# Altium schematic sheet mach nhan tin hieu.SchDoc
size A2
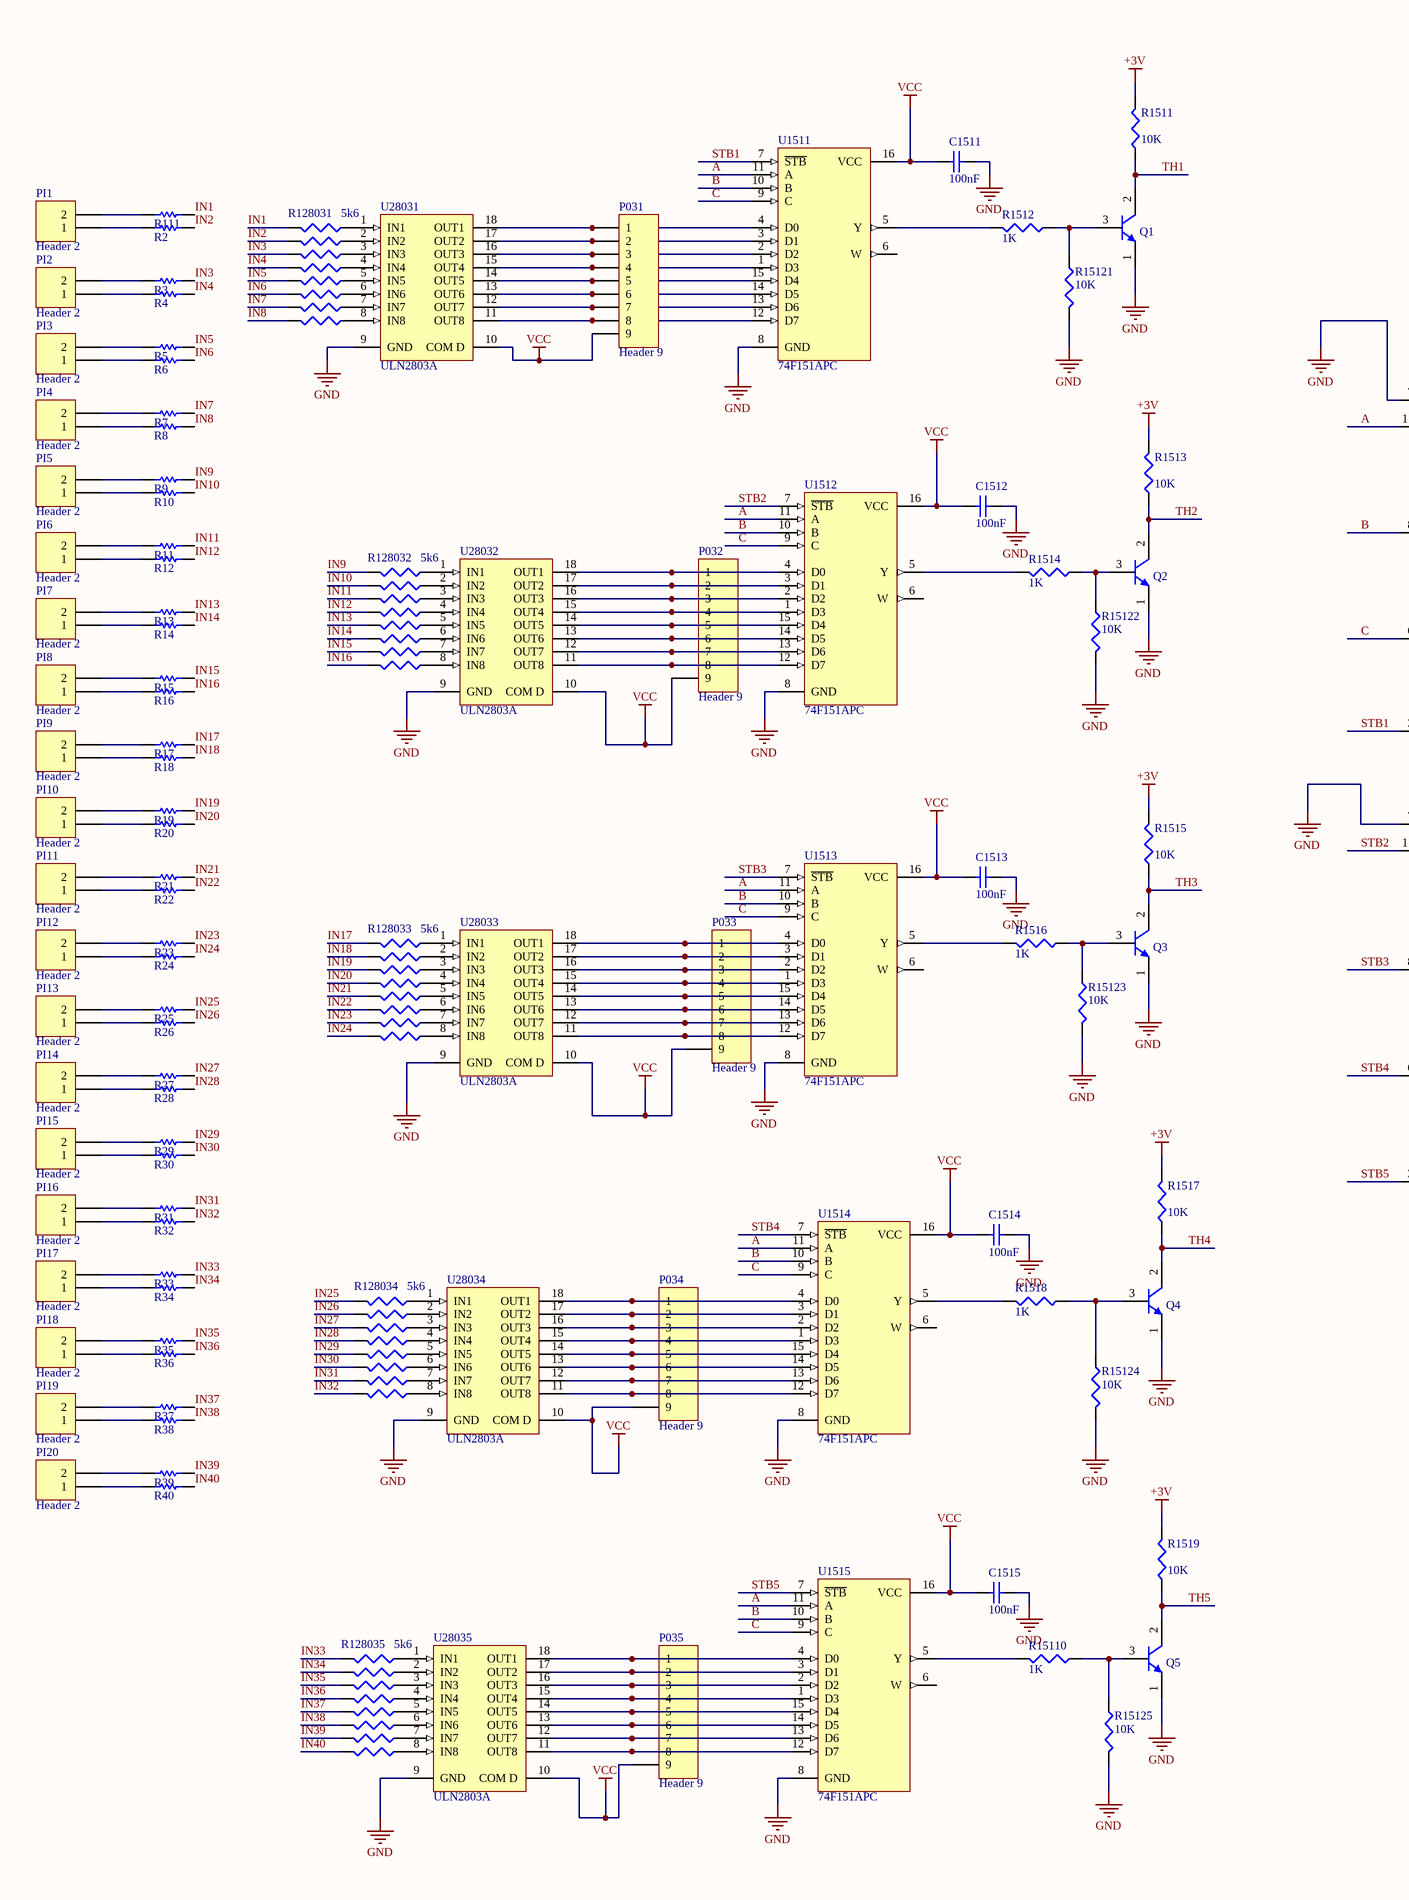
[diagram p0: mach nhan tin hieu.SchDoc, left]
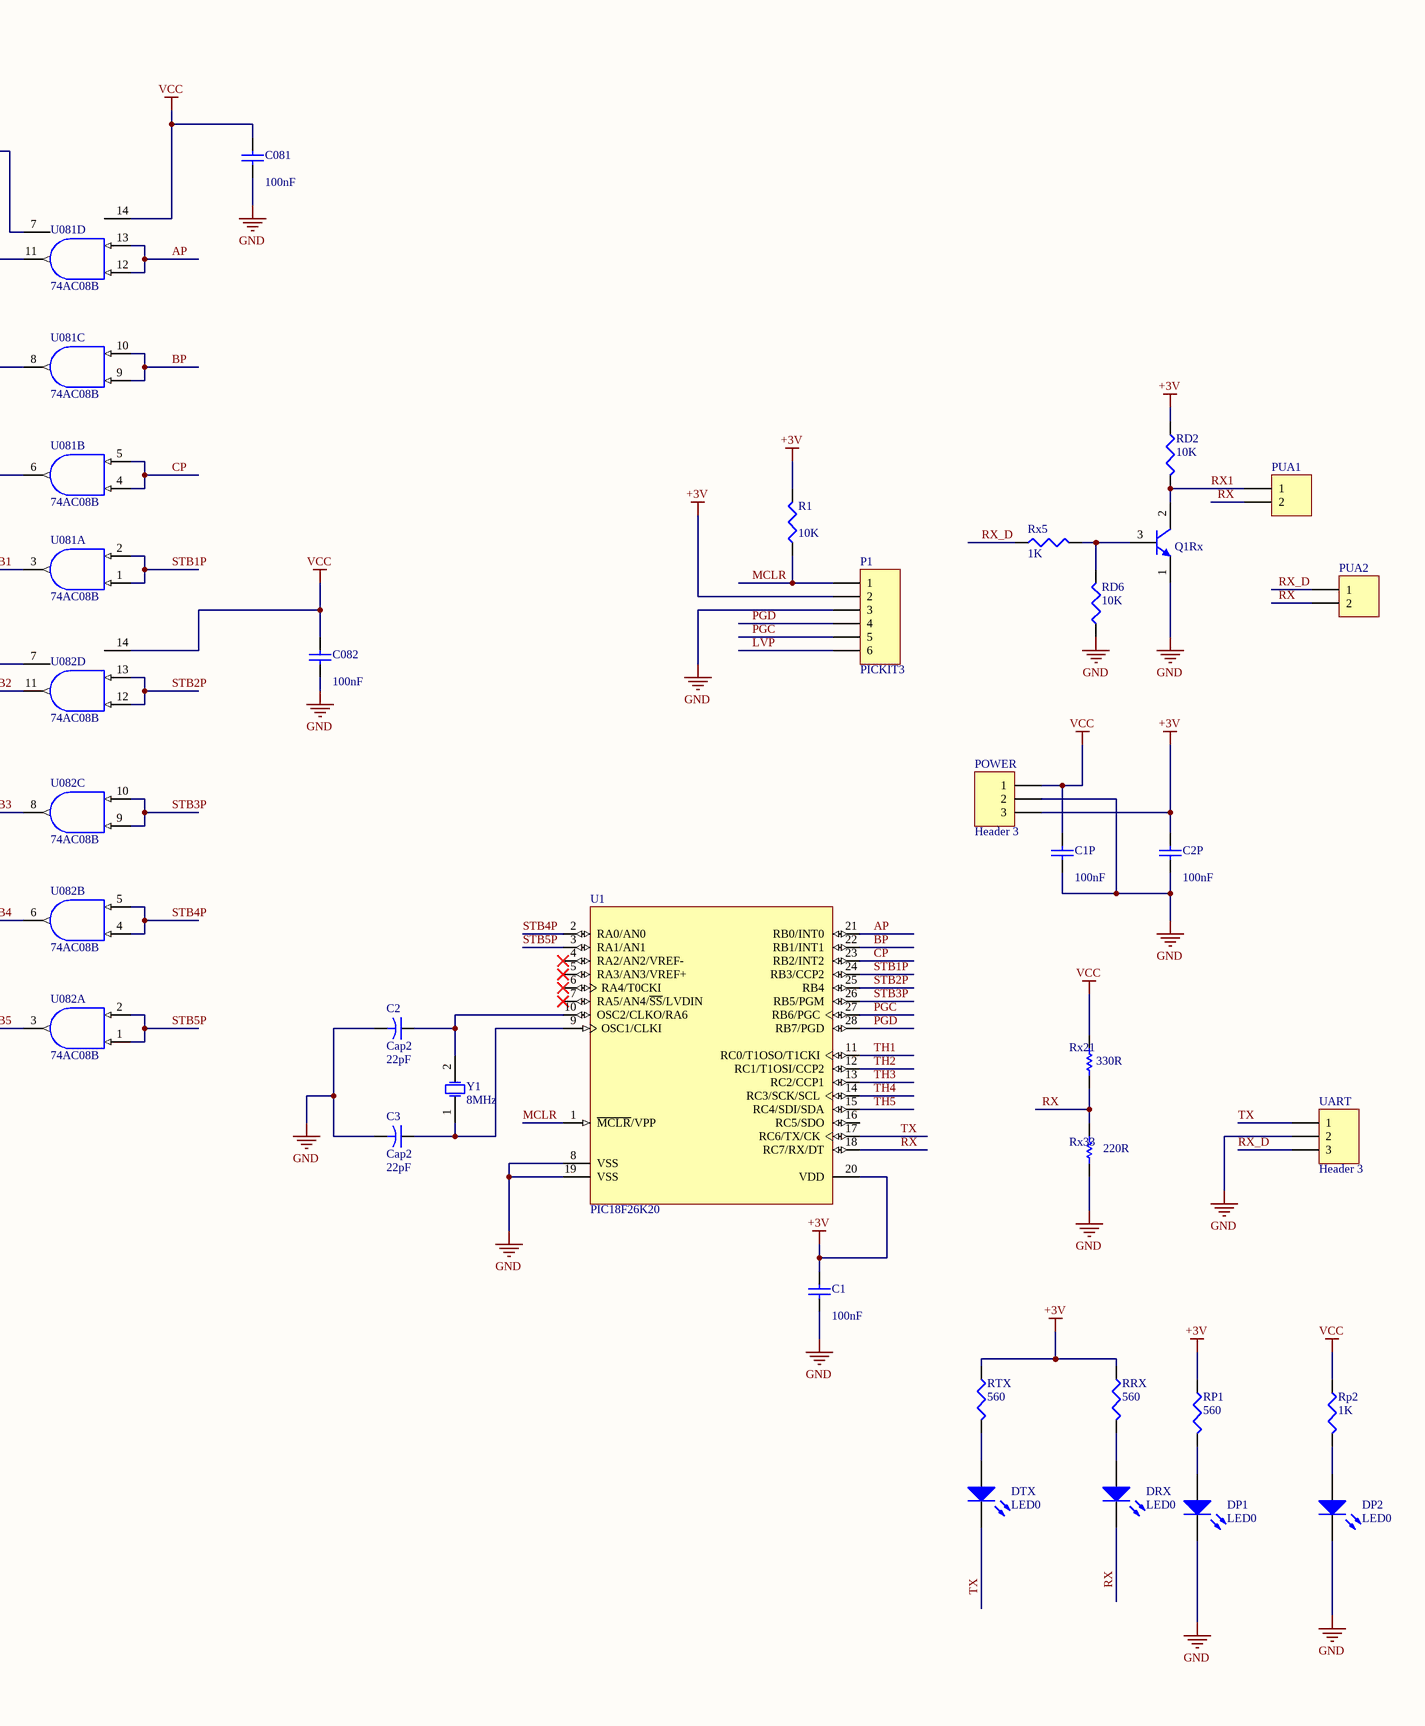
[diagram p1: mach nhan tin hieu.SchDoc, right]

## Parts
C1  value 100nF  [tu_gom]  (hidden comment: Cap)
C1P  value 100nF  [tu_gom]  (hidden comment: Cap)
C2  Cap2  value 22pF  [tu_gom]
C2P  value 100nF  [tu_gom]  (hidden comment: Cap)
C3  Cap2  value 22pF  [tu_gom]
C081  value 100nF  [tu_gom]  (hidden comment: Cap)
C082  value 100nF  [tu_gom]  (hidden comment: Cap)
C1511  value 100nF  [tu_gom]  (hidden comment: Cap)
C1512  value 100nF  [tu_gom]  (hidden comment: Cap)
C1513  value 100nF  [tu_gom]  (hidden comment: Cap)
C1514  value 100nF  [tu_gom]  (hidden comment: Cap)
C1515  value 100nF  [tu_gom]  (hidden comment: Cap)
DP1  LED0  [LED_3]
DP2  LED0  [LED_3]
DRX  LED0  [LED_3]
DTX  LED0  [LED_3]
P1  PICKIT3  [HDR1X6]
P031  Header 9  [HDR1X9]
P032  Header 9  [HDR1X9]
P033  Header 9  [HDR1X9]
P034  Header 9  [HDR1X9]
P035  Header 9  [HDR1X9]
PI1  Header 2  [Header_nguon_20A]
PI2  Header 2  [Header_nguon_20A]
PI3  Header 2  [Header_nguon_20A]
PI4  Header 2  [Header_nguon_20A]
PI5  Header 2  [Header_nguon_20A]
PI6  Header 2  [Header_nguon_20A]
PI7  Header 2  [Header_nguon_20A]
PI8  Header 2  [Header_nguon_20A]
PI9  Header 2  [Header_nguon_20A]
PI10  Header 2  [Header_nguon_20A]
PI11  Header 2  [Header_nguon_20A]
PI12  Header 2  [Header_nguon_20A]
PI13  Header 2  [Header_nguon_20A]
PI14  Header 2  [Header_nguon_20A]
PI15  Header 2  [Header_nguon_20A]
PI16  Header 2  [Header_nguon_20A]
PI17  Header 2  [Header_nguon_20A]
PI18  Header 2  [Header_nguon_20A]
PI19  Header 2  [Header_nguon_20A]
PI20  Header 2  [Header_nguon_20A]
POWER  Header 3  [HEADER3]
PUA1  Header 2  [HDR1X2]  (value not drawn)
PUA2  Header 2  [HDR1X2]  (value not drawn)
Q1  C1815  [C1815]  (value not drawn)
Q1Rx  C1815  [C1815]  (value not drawn)
Q2  C1815  [C1815]  (value not drawn)
Q3  C1815  [C1815]  (value not drawn)
Q4  C1815  [C1815]  (value not drawn)
Q5  C1815  [C1815]  (value not drawn)
R1  value 10K  [R_Nor]  (hidden comment: Res3)
R2  Res  [R_Nor]  (value not drawn)
R3  Res  [R_Nor]  (value not drawn)
R4  Res  [R_Nor]  (value not drawn)
R5  Res  [R_Nor]  (value not drawn)
R6  Res  [R_Nor]  (value not drawn)
R7  Res  [R_Nor]  (value not drawn)
R8  Res  [R_Nor]  (value not drawn)
R9  Res  [R_Nor]  (value not drawn)
R10  Res  [R_Nor]  (value not drawn)
R11  Res  [R_Nor]  (value not drawn)
R12  Res  [R_Nor]  (value not drawn)
R13  Res  [R_Nor]  (value not drawn)
R14  Res  [R_Nor]  (value not drawn)
R15  Res  [R_Nor]  (value not drawn)
R16  Res  [R_Nor]  (value not drawn)
R17  Res  [R_Nor]  (value not drawn)
R18  Res  [R_Nor]  (value not drawn)
R19  Res  [R_Nor]  (value not drawn)
R20  Res  [R_Nor]  (value not drawn)
R21  Res  [R_Nor]  (value not drawn)
R22  Res  [R_Nor]  (value not drawn)
R23  Res  [R_Nor]  (value not drawn)
R24  Res  [R_Nor]  (value not drawn)
R25  Res  [R_Nor]  (value not drawn)
R26  Res  [R_Nor]  (value not drawn)
R27  Res  [R_Nor]  (value not drawn)
R28  Res  [R_Nor]  (value not drawn)
R29  Res  [R_Nor]  (value not drawn)
R30  Res  [R_Nor]  (value not drawn)
R31  Res  [R_Nor]  (value not drawn)
R32  Res  [R_Nor]  (value not drawn)
R33  Res  [R_Nor]  (value not drawn)
R34  Res  [R_Nor]  (value not drawn)
R35  Res  [R_Nor]  (value not drawn)
R36  Res  [R_Nor]  (value not drawn)
R37  Res  [R_Nor]  (value not drawn)
R38  Res  [R_Nor]  (value not drawn)
R39  Res  [R_Nor]  (value not drawn)
R40  Res  [R_Nor]  (value not drawn)
R111  Res  [R_Nor]  (value not drawn)
R1511  value 10K  [R_Nor]  (hidden comment: Res3)
R1512  value 1K  [R_Nor]  (hidden comment: Res3)
R1513  value 10K  [R_Nor]  (hidden comment: Res3)
R1514  value 1K  [R_Nor]  (hidden comment: Res3)
R1515  value 10K  [R_Nor]  (hidden comment: Res3)
R1516  value 1K  [R_Nor]  (hidden comment: Res3)
R1517  value 10K  [R_Nor]  (hidden comment: Res3)
R1518  value 1K  [R_Nor]  (hidden comment: Res3)
R1519  value 10K  [R_Nor]  (hidden comment: Res3)
R15110  value 1K  [R_Nor]  (hidden comment: Res3)
R15121  value 10K  [R_Nor]  (hidden comment: Res3)
R15122  value 10K  [R_Nor]  (hidden comment: Res3)
R15123  value 10K  [R_Nor]  (hidden comment: Res3)
R15124  value 10K  [R_Nor]  (hidden comment: Res3)
R15125  value 10K  [R_Nor]  (hidden comment: Res3)
R42802  Res3  [R_Nor]  (value not drawn)
R42803  Res3  [R_Nor]  (value not drawn)
R42804  Res3  [R_Nor]  (value not drawn)
R128031  value 5k6  [R_Nor]  (hidden comment: Res3)
R128032  value 5k6  [R_Nor]  (hidden comment: Res3)
R128033  value 5k6  [R_Nor]  (hidden comment: Res3)
R128034  value 5k6  [R_Nor]  (hidden comment: Res3)
R128035  value 5k6  [R_Nor]  (hidden comment: Res3)
R228031  Res3  [R_Nor]  (value not drawn)
R228032  Res3  [R_Nor]  (value not drawn)
R228033  Res3  [R_Nor]  (value not drawn)
R228034  Res3  [R_Nor]  (value not drawn)
R228035  Res3  [R_Nor]  (value not drawn)
R328031  Res3  [R_Nor]  (value not drawn)
R328032  Res3  [R_Nor]  (value not drawn)
R328033  Res3  [R_Nor]  (value not drawn)
R328034  Res3  [R_Nor]  (value not drawn)
R328035  Res3  [R_Nor]  (value not drawn)
R428031  Res3  [R_Nor]  (value not drawn)
R428035  Res3  [R_Nor]  (value not drawn)
R528031  Res3  [R_Nor]  (value not drawn)
R528032  Res3  [R_Nor]  (value not drawn)
R528033  Res3  [R_Nor]  (value not drawn)
R528034  Res3  [R_Nor]  (value not drawn)
R528035  Res3  [R_Nor]  (value not drawn)
R628031  Res3  [R_Nor]  (value not drawn)
R628032  Res3  [R_Nor]  (value not drawn)
R628033  Res3  [R_Nor]  (value not drawn)
R628034  Res3  [R_Nor]  (value not drawn)
R628035  Res3  [R_Nor]  (value not drawn)
R728031  Res3  [R_Nor]  (value not drawn)
R728032  Res3  [R_Nor]  (value not drawn)
R728033  Res3  [R_Nor]  (value not drawn)
R728034  Res3  [R_Nor]  (value not drawn)
R728035  Res3  [R_Nor]  (value not drawn)
R828031  Res3  [R_Nor]  (value not drawn)
R828032  Res3  [R_Nor]  (value not drawn)
R828033  Res3  [R_Nor]  (value not drawn)
R828034  Res3  [R_Nor]  (value not drawn)
R828035  Res3  [R_Nor]  (value not drawn)
RD2  value 10K  [R_Nor]  (hidden comment: Res3)
RD6  value 10K  [R_Nor]  (hidden comment: Res3)
RP1  value 560  [R_Nor]  (hidden comment: Res3)
Rp2  value 1K  [R_Nor]  (hidden comment: Res3)
RRX  value 560  [R_Nor]  (hidden comment: Res3)
RTX  value 560  [R_Nor]  (hidden comment: Res3)
Rx5  value 1K  [R_Nor]  (hidden comment: Res3)
Rx21  330R  [R_Nor]
Rx33  220R  [R_Nor]
U1  PIC18F26K20  [SOIC300-28_N]
U081  74AC08B  [DIP14]  (parts A,B,C,D of 4)
U082  74AC08B  [DIP14]  (parts A,B,C,D of 4)
U1511  74F151APC  [N16E]
U1512  74F151APC  [N16E]
U1513  74F151APC  [N16E]
U1514  74F151APC  [N16E]
U1515  74F151APC  [N16E]
U28031  ULN2803A  [DIP18]
U28032  ULN2803A  [DIP18]
U28033  ULN2803A  [DIP18]
U28034  ULN2803A  [DIP18]
U28035  ULN2803A  [DIP18]
UART  Header 3  [HEADER3]
Y1  8MHz  [Xtal12M]

## Nets
+3V: C1.1 C2P.1 P1.2 POWER.3 R1.2 R1511.2 R1513.2 R1515.2 R1517.2 R1519.2 RD2.1 RP1.1 RRX.1 RTX.1 U1.20(VDD)
GND: C1.2 C1P.2 C2.2 C2P.2 C3.2 C081.2 C082.2 C1511.2 C1512.2 C1513.2 C1514.2 C1515.2 DP1.2(K) DP2.2(K) P1.3 POWER.2 Q1.1(E) Q1Rx.1(E) Q2.1(E) Q3.1(E) Q4.1(E) Q5.1(E) R15121.2 R15122.2 R15123.2 R15124.2 R15125.2 RD6.1 Rx33.1 U1.8(VSS) U1.19(VSS) U081.7(GND) U082.7(GND) U1511.8(GND) U1512.8(GND) U1513.8(GND) U1514.8(GND) U1515.8(GND) U28031.9(GND) U28032.9(GND) U28033.9(GND) U28034.9(GND) U28035.9(GND) UART.2
VCC: C1P.1 C081.1 C082.1 C1511.1 C1512.1 C1513.1 C1514.1 C1515.1 P031.9 P032.9 P033.9 P034.9 P035.9 POWER.1 Rp2.1 Rx21.2 U081.14(VCC) U082.14(VCC) U1511.16(VCC) U1512.16(VCC) U1513.16(VCC) U1514.16(VCC) U1515.16(VCC) U28031.10(COM_D) U28032.10(COM_D) U28033.10(COM_D) U28034.10(COM_D) U28035.10(COM_D)
A: U081.11(Y) U1511.11(A) U1512.11(A) U1513.11(A) U1514.11(A) U1515.11(A)
AP: U1.21(RB0/INT0) U081.12(A) U081.13(B)
B: U081.8(Y) U1511.10(B) U1512.10(B) U1513.10(B) U1514.10(B) U1515.10(B)
BP: U1.22(RB1/INT1) U081.9(A) U081.10(B)
C: U081.6(Y) U1511.9(C) U1512.9(C) U1513.9(C) U1514.9(C) U1515.9(C)
CP: U1.23(RB2/INT2) U081.4(A) U081.5(B)
IN1: R111.2 R128031.2
IN2: R2.2 R228031.2
IN3: R3.2 R328031.2
IN4: R4.2 R428031.2
IN5: R5.2 R528031.2
IN6: R6.2 R628031.2
IN7: R7.2 R728031.2
IN8: R8.2 R828031.2
IN9: R9.2 R128032.2
IN10: R10.2 R228032.2
IN11: R11.2 R328032.2
IN12: R12.2 R42802.2
IN13: R13.2 R528032.2
IN14: R14.2 R628032.2
IN15: R15.2 R728032.2
IN16: R16.2 R828032.2
IN17: R17.2 R128033.2
IN18: R18.2 R228033.2
IN19: R19.2 R328033.2
IN20: R20.2 R42803.2
IN21: R21.2 R528033.2
IN22: R22.2 R628033.2
IN23: R23.2 R728033.2
IN24: R24.2 R828033.2
IN25: R25.2 R128034.2
IN26: R26.2 R228034.2
IN27: R27.2 R328034.2
IN28: R28.2 R42804.2
IN29: R29.2 R528034.2
IN30: R30.2 R628034.2
IN31: R31.2 R728034.2
IN32: R32.2 R828034.2
IN33: R33.2 R128035.2
IN34: R34.2 R228035.2
IN35: R35.2 R328035.2
IN36: R36.2 R428035.2
IN37: R37.2 R528035.2
IN38: R38.2 R628035.2
IN39: R39.2 R728035.2
IN40: R40.2 R828035.2
LVP: P1.6
MCLR: P1.1 R1.1 U1.1(~{MCLR}/VPP)
PGC: P1.5 U1.27(RB6/PGC)
PGD: P1.4 U1.28(RB7/PGD)
RX: DRX.2(K) PUA1.2 PUA2.2 Rx21.1 Rx33.2 U1.18(RC7/RX/DT)
RX1: PUA1.1 Q1Rx.2(C) RD2.2
RX_D: PUA2.1 Rx5.1 UART.3
STB1: U081.3(Y) U1511.7(~{STB})
STB1P: U1.24(RB3/CCP2) U081.1(A) U081.2(B)
STB2: U082.11(Y) U1512.7(~{STB})
STB2P: U1.25(RB4) U082.12(A) U082.13(B)
STB3: U082.8(Y) U1513.7(~{STB})
STB3P: U1.26(RB5/PGM) U082.9(A) U082.10(B)
STB4: U082.6(Y) U1514.7(~{STB})
STB4P: U1.2(RA0/AN0) U082.4(A) U082.5(B)
STB5: U082.3(Y) U1515.7(~{STB})
STB5P: U1.3(RA1/AN1) U082.1(A) U082.2(B)
TH1: Q1.2(C) R1511.1 U1.11(RC0/T1OSO/T1CKI)
TH2: Q2.2(C) R1513.1 U1.12(RC1/T1OSI/CCP2)
TH3: Q3.2(C) R1515.1 U1.13(RC2/CCP1)
TH4: Q4.2(C) R1517.1 U1.14(RC3/SCK/SCL)
TH5: Q5.2(C) R1519.1 U1.15(RC4/SDI/SDA)
TX: DTX.2(K) U1.17(RC6/TX/CK) UART.1
NetC2_1: C2.1 U1.10(OSC2/CLKO/RA6) Y1.2(OSC2)
NetC3_1: C3.1 U1.9(OSC1/CLKI) Y1.1(OSC1)
NetDP1_1: DP1.1(A) RP1.2
NetDP2_1: DP2.1(A) Rp2.2
NetDRX_1: DRX.1(A) RRX.2
NetDTX_1: DTX.1(A) RTX.2
NetP031_1: P031.1 U1511.4(D0) U28031.18(OUT1)
NetP031_2: P031.2 U1511.3(D1) U28031.17(OUT2)
NetP031_3: P031.3 U1511.2(D2) U28031.16(OUT3)
NetP031_4: P031.4 U1511.1(D3) U28031.15(OUT4)
NetP031_5: P031.5 U1511.15(D4) U28031.14(OUT5)
NetP031_6: P031.6 U1511.14(D5) U28031.13(OUT6)
NetP031_7: P031.7 U1511.13(D6) U28031.12(OUT7)
NetP031_8: P031.8 U1511.12(D7) U28031.11(OUT8)
NetP032_1: P032.1 U1512.4(D0) U28032.18(OUT1)
NetP032_2: P032.2 U1512.3(D1) U28032.17(OUT2)
NetP032_3: P032.3 U1512.2(D2) U28032.16(OUT3)
NetP032_4: P032.4 U1512.1(D3) U28032.15(OUT4)
NetP032_5: P032.5 U1512.15(D4) U28032.14(OUT5)
NetP032_6: P032.6 U1512.14(D5) U28032.13(OUT6)
NetP032_7: P032.7 U1512.13(D6) U28032.12(OUT7)
NetP032_8: P032.8 U1512.12(D7) U28032.11(OUT8)
NetP033_1: P033.1 U1513.4(D0) U28033.18(OUT1)
NetP033_2: P033.2 U1513.3(D1) U28033.17(OUT2)
NetP033_3: P033.3 U1513.2(D2) U28033.16(OUT3)
NetP033_4: P033.4 U1513.1(D3) U28033.15(OUT4)
NetP033_5: P033.5 U1513.15(D4) U28033.14(OUT5)
NetP033_6: P033.6 U1513.14(D5) U28033.13(OUT6)
NetP033_7: P033.7 U1513.13(D6) U28033.12(OUT7)
NetP033_8: P033.8 U1513.12(D7) U28033.11(OUT8)
NetP034_1: P034.1 U1514.4(D0) U28034.18(OUT1)
NetP034_2: P034.2 U1514.3(D1) U28034.17(OUT2)
NetP034_3: P034.3 U1514.2(D2) U28034.16(OUT3)
NetP034_4: P034.4 U1514.1(D3) U28034.15(OUT4)
NetP034_5: P034.5 U1514.15(D4) U28034.14(OUT5)
NetP034_6: P034.6 U1514.14(D5) U28034.13(OUT6)
NetP034_7: P034.7 U1514.13(D6) U28034.12(OUT7)
NetP034_8: P034.8 U1514.12(D7) U28034.11(OUT8)
NetP035_1: P035.1 U1515.4(D0) U28035.18(OUT1)
NetP035_2: P035.2 U1515.3(D1) U28035.17(OUT2)
NetP035_3: P035.3 U1515.2(D2) U28035.16(OUT3)
NetP035_4: P035.4 U1515.1(D3) U28035.15(OUT4)
NetP035_5: P035.5 U1515.15(D4) U28035.14(OUT5)
NetP035_6: P035.6 U1515.14(D5) U28035.13(OUT6)
NetP035_7: P035.7 U1515.13(D6) U28035.12(OUT7)
NetP035_8: P035.8 U1515.12(D7) U28035.11(OUT8)
NetPI1_1: PI1.1(2) R111.1
NetPI1_2: PI1.2(1) R2.1
NetPI2_1: PI2.1(2) R3.1
NetPI2_2: PI2.2(1) R4.1
NetPI3_1: PI3.1(2) R5.1
NetPI3_2: PI3.2(1) R6.1
NetPI4_1: PI4.1(2) R7.1
NetPI4_2: PI4.2(1) R8.1
NetPI5_1: PI5.1(2) R9.1
NetPI5_2: PI5.2(1) R10.1
NetPI6_1: PI6.1(2) R11.1
NetPI6_2: PI6.2(1) R12.1
NetPI7_1: PI7.1(2) R13.1
NetPI7_2: PI7.2(1) R14.1
NetPI8_1: PI8.1(2) R15.1
NetPI8_2: PI8.2(1) R16.1
NetPI9_1: PI9.1(2) R17.1
NetPI9_2: PI9.2(1) R18.1
NetPI10_1: PI10.1(2) R19.1
NetPI10_2: PI10.2(1) R20.1
NetPI11_1: PI11.1(2) R21.1
NetPI11_2: PI11.2(1) R22.1
NetPI12_1: PI12.1(2) R23.1
NetPI12_2: PI12.2(1) R24.1
NetPI13_1: PI13.1(2) R25.1
NetPI13_2: PI13.2(1) R26.1
NetPI14_1: PI14.1(2) R27.1
NetPI14_2: PI14.2(1) R28.1
NetPI15_1: PI15.1(2) R29.1
NetPI15_2: PI15.2(1) R30.1
NetPI16_1: PI16.1(2) R31.1
NetPI16_2: PI16.2(1) R32.1
NetPI17_1: PI17.1(2) R33.1
NetPI17_2: PI17.2(1) R34.1
NetPI18_1: PI18.1(2) R35.1
NetPI18_2: PI18.2(1) R36.1
NetPI19_1: PI19.1(2) R37.1
NetPI19_2: PI19.2(1) R38.1
NetPI20_1: PI20.1(2) R39.1
NetPI20_2: PI20.2(1) R40.1
NetQ1_3: Q1.3(B) R1512.1 R15121.1
NetQ1Rx_3: Q1Rx.3(B) RD6.2 Rx5.2
NetQ2_3: Q2.3(B) R1514.1 R15122.1
NetQ3_3: Q3.3(B) R1516.1 R15123.1
NetQ4_3: Q4.3(B) R1518.1 R15124.1
NetQ5_3: Q5.3(B) R15110.1 R15125.1
NetR1512_2: R1512.2 U1511.5(Y)
NetR1514_2: R1514.2 U1512.5(Y)
NetR1516_2: R1516.2 U1513.5(Y)
NetR1518_2: R1518.2 U1514.5(Y)
NetR15110_2: R15110.2 U1515.5(Y)
NetR42802_1: R42802.1 U28032.4(IN4)
NetR42803_1: R42803.1 U28033.4(IN4)
NetR42804_1: R42804.1 U28034.4(IN4)
NetR128031_1: R128031.1 U28031.1(IN1)
NetR128032_1: R128032.1 U28032.1(IN1)
NetR128033_1: R128033.1 U28033.1(IN1)
NetR128034_1: R128034.1 U28034.1(IN1)
NetR128035_1: R128035.1 U28035.1(IN1)
NetR228031_1: R228031.1 U28031.2(IN2)
NetR228032_1: R228032.1 U28032.2(IN2)
NetR228033_1: R228033.1 U28033.2(IN2)
NetR228034_1: R228034.1 U28034.2(IN2)
NetR228035_1: R228035.1 U28035.2(IN2)
NetR328031_1: R328031.1 U28031.3(IN3)
NetR328032_1: R328032.1 U28032.3(IN3)
NetR328033_1: R328033.1 U28033.3(IN3)
NetR328034_1: R328034.1 U28034.3(IN3)
NetR328035_1: R328035.1 U28035.3(IN3)
NetR428031_1: R428031.1 U28031.4(IN4)
NetR428035_1: R428035.1 U28035.4(IN4)
NetR528031_1: R528031.1 U28031.5(IN5)
NetR528032_1: R528032.1 U28032.5(IN5)
NetR528033_1: R528033.1 U28033.5(IN5)
NetR528034_1: R528034.1 U28034.5(IN5)
NetR528035_1: R528035.1 U28035.5(IN5)
NetR628031_1: R628031.1 U28031.6(IN6)
NetR628032_1: R628032.1 U28032.6(IN6)
NetR628033_1: R628033.1 U28033.6(IN6)
NetR628034_1: R628034.1 U28034.6(IN6)
NetR628035_1: R628035.1 U28035.6(IN6)
NetR728031_1: R728031.1 U28031.7(IN7)
NetR728032_1: R728032.1 U28032.7(IN7)
NetR728033_1: R728033.1 U28033.7(IN7)
NetR728034_1: R728034.1 U28034.7(IN7)
NetR728035_1: R728035.1 U28035.7(IN7)
NetR828031_1: R828031.1 U28031.8(IN8)
NetR828032_1: R828032.1 U28032.8(IN8)
NetR828033_1: R828033.1 U28033.8(IN8)
NetR828034_1: R828034.1 U28034.8(IN8)
NetR828035_1: R828035.1 U28035.8(IN8)

Not connected (* = marked no-connect by the designer): U1 4(RA2/AN2/VREF-)* 5(RA3/AN3/VREF+)* 6(RA4/T0CKI)* 7(RA5/AN4/~{SS}/LVDIN)* 16(RC5/SDO); U1511 6(W); U1512 6(W); U1513 6(W); U1514 6(W); U1515 6(W)

## Library data of the parts
C1 C1P C2P C081 C082 C1511-C1515 = Cap: Capacitor; Published: 8-Jun-2000; LatestRevisionDate: 17-Jul-2002; LatestRevisionNote: Re-released for DXP Platform.; PackageReference: RAD-0.3; Publisher: Altium Limited
C2 C3 = Cap2: Capacitor; Published: 23-Sep-2002; PackageReference: CAPR5-4X5; Publisher: Altium Limited
DP1 DP2 DRX DTX = LED0: Typical INFRARED GaAs LED; Published: 8-Jun-2000; LatestRevisionDate: 08-Jul-2005; LatestRevisionNote: Mech Layer 1 removed.; PackageReference: LED-0; Publisher: Altium Limited
P1 = Header 6: Header, 6-Pin; LatestRevisionDate: 17-Jul-2002; LatestRevisionNote: Re-released for DXP Platform.; Publisher: Altium Limited
P031 P032 P033 P034 P035 = Header 9: Header, 9-Pin; LatestRevisionDate: 17-Jul-2002; LatestRevisionNote: Re-released for DXP Platform.; Publisher: Altium Limited
PI1-PI20 PUA1 PUA2 = Header 2: Header, 2-Pin; LatestRevisionDate: 17-Jul-2002; LatestRevisionNote: Re-released for DXP Platform.; Publisher: Altium Limited
POWER UART = Header 3: Header, 3-Pin; LatestRevisionDate: 17-Jul-2002; LatestRevisionNote: Re-released for DXP Platform.; Publisher: Altium Limited
R1 R1511-R1519 R15110 R15121-R15125 R128031-R128035 RD2 RD6 RP1 Rp2 RRX RTX Rx5 = Res3: Resistor; Published: 8-Jun-2000; LatestRevisionDate: 04-Mar-2005; LatestRevisionNote: PCB Footprint replaced.; PackageReference: J1-0603; Publisher: Altium Limited
R42802 R42804 R228031-R228035 R328031-R328035 R428031 R428035 R528031-R528035 R628031-R628035 R728031-R728035 R828031-R828035 = Res3: Resistor; Value: 560; Published: 8-Jun-2000; LatestRevisionDate: 04-Mar-2005; LatestRevisionNote: PCB Footprint replaced.; PackageReference: J1-0603; Publisher: Altium Limited
R42803 = Res3: Resistor; Value: 1k; Published: 8-Jun-2000; LatestRevisionDate: 04-Mar-2005; LatestRevisionNote: PCB Footprint replaced.; PackageReference: J1-0603; Publisher: Altium Limited
Rx21 Rx33 = Res
U1 = PIC18F242-E/SO: High Performance, Enhanced FLASH Microcontroller with 10-Bit A/D, 16K FLASH, 28-Pin SOIC, Standard Volt Range, Extended Temperature; Note: RB3 is the alternate pin for the CCP2 pin multiplexing.; Published: 11-Oct-2004; LatestRevisionDate: 13-Apr-2006; LatestRevisionNote: IPC-7351 Footprint Added.; DatasheetVersion: DS39564B_2002; PackageVersion: 2005; PackageReference: SOIC300-28; Publisher: Altium Limited; PackageDescription: 28-Pin Small Outline Integrated Circuit 1.27 mm Pitch; Code_JEDEC: MS-013; ComponentLink1Description: Manufacturer Link; ComponentLink1URL: http://www.microchip.com; ComponentLink2Description: Datasheet; ComponentLink2URL: http://ww1.microchip.com/downloads/en/DeviceDoc/39564b.pdf; ComponentLink3Description: Packaging Specification; ComponentLink3URL: http://ww1.microchip.com/downloads/en/PackagingSpec/00049AD.pdf
U081 U082 = 74AC08B: Quad 2-Input AND Gate; Published: 8-Jun-2000; LatestRevisionDate: 06-Jun-2005; LatestRevisionNote: Stylized 3D Model Added.; DatasheetVersion: Apr-1997; PackageVersion: Jan-1997; PackageReference: DIP14; Publisher: Altium Limited; PackageDescription: DIP; 14 Leads; Row Spacing 7.62 mm; Pitch 2.54 mm; ComponentLink1Description: Manufacturer Link; ComponentLink1URL: http://www.st.com/; ComponentLink2Description: Datasheet; ComponentLink2URL: http://www.st.com/stonline/products/literature/ds/4694/74ac08.pdf
U1511-U1515 = 74F151APC: 8-Input Multiplexer; Published: 15-Apr-2002; LatestRevisionDate: 06-Jun-2005; LatestRevisionNote: Stylized 3D Model Added.; DatasheetVersion: Nov-1994; PackageVersion: 2000; PackageReference: N16E; Publisher: Altium Limited; PackageDescription: DIP; 16 Leads; Row Spacing 7.62 mm; Pitch 2.54 mm; ComponentLink1Description: Manufacturer Link; ComponentLink1URL: http://www.national.com/; ComponentLink2Description: Datasheet; ComponentLink2URL: http://www.fairchildsemi.com/ds/74/74F151A.pdf; ComponentLink3Description: URL Link1; ComponentLink3URL: http://www.fairchildsemi.com/pf/74/74F151A.html
U28031-U28035 = ULN2803A: Eight Darlington Array; Published: 8-Jun-2000; LatestRevisionDate: 06-Jun-2005; LatestRevisionNote: Stylized 3D Model Added.; DatasheetVersion: Sep-1997; PackageReference: DIP18; Publisher: Altium Limited; PackageDescription: DIP; 18 Leads; Row Spacing 7.62 mm; Pitch 2.54 mm; ComponentLink1Description: Manufacturer Link; ComponentLink1URL: http://www.st.com/; ComponentLink2Description: Datasheet; ComponentLink2URL: http://www.st.com/stonline/products/literature/ds/1536/uln2801a.pdf
Y1 = XTAL: Crystal Oscillator; Published: 8-Jun-2000; LatestRevisionDate: 17-Jul-2002; LatestRevisionNote: Re-released for DXP Platform.; PackageReference: R38; Publisher: Altium Limited